# Altium schematic sheet V1.0.SchDoc
size 38 x 30 mm
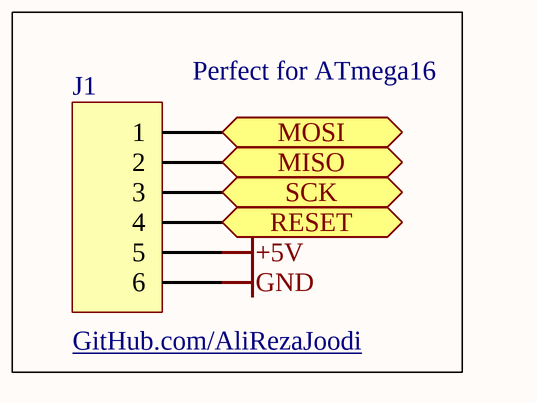
[diagram p0: V1.0.SchDoc]

## Parts
J1  6 PIN  [HDR1X6]  (value not drawn)

## Ports
MISO, MOSI, RESET, SCK

## Nets
+5V: J1.5
GND: J1.6
MISO: J1.2 ; port MISO
MOSI: J1.1 ; port MOSI
RESET: J1.4 ; port RESET
SCK: J1.3 ; port SCK

## Notes on the sheet
- (near J1) Perfect for ATmega16
- (near J1) GitHub.com/AliRezaJoodi

## Library data of the parts
J1 = Header 6: Header, 6-Pin; LatestRevisionDate: 17-Jul-2002; LatestRevisionNote: Re-released for DXP Platform.; Publisher: Altium Limited